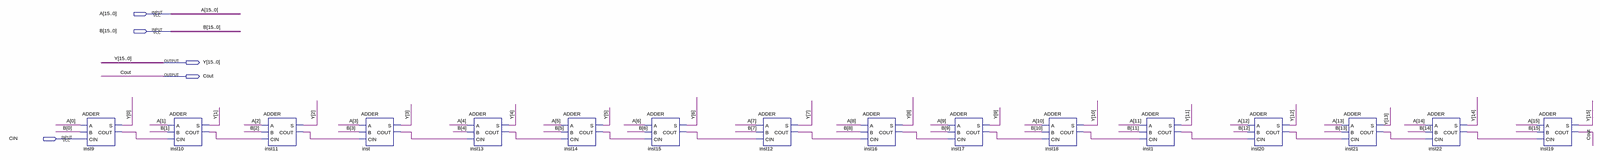
[diagram p0: schematic sheet, whole]
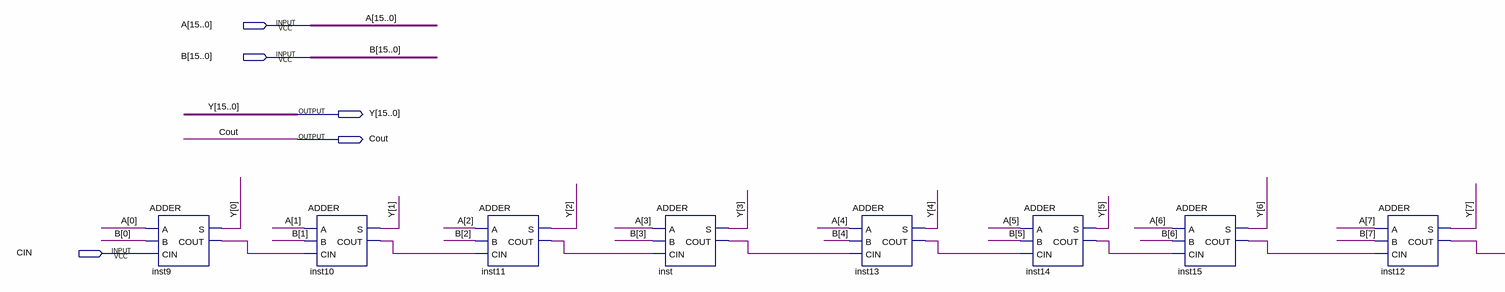
[diagram p1: schematic sheet, left part]
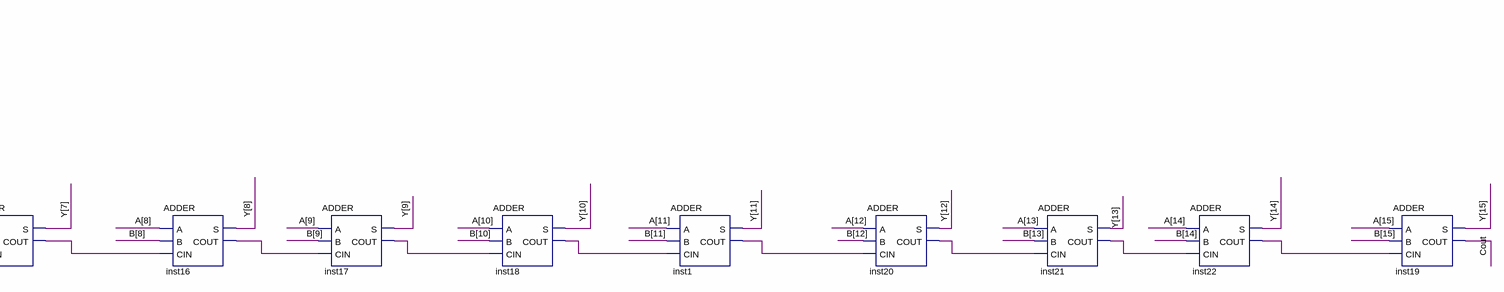
[diagram p2: schematic sheet, right part]
// Quartus schematic ADDER16bit.bdf as structural Verilog: 16 symbols, 5 pins
module ADDER16bit (
  input  [15:0] A,
  input  [15:0] B,
  input  CIN,
  output [15:0] Y,
  output Cout
);

  wire inst1_cout, inst9_cout, inst10_cout, inst11_cout, inst12_cout, inst13_cout, inst14_cout, inst15_cout,
       inst16_cout, inst17_cout, inst18_cout, inst20_cout, inst21_cout, inst22_cout, inst_cout;

  ADDER inst9 (.A(A[0]), .B(B[0]), .CIN(CIN), .S(Y[0]), .COUT(inst9_cout));
  ADDER inst10 (.A(A[1]), .B(B[1]), .CIN(inst9_cout), .S(Y[1]), .COUT(inst10_cout));
  ADDER inst11 (.A(A[2]), .B(B[2]), .CIN(inst10_cout), .S(Y[2]), .COUT(inst11_cout));
  ADDER inst (.A(A[3]), .B(B[3]), .CIN(inst11_cout), .S(Y[3]), .COUT(inst_cout));
  ADDER inst13 (.A(A[4]), .B(B[4]), .CIN(inst_cout), .S(Y[4]), .COUT(inst13_cout));
  ADDER inst14 (.A(A[5]), .B(B[5]), .CIN(inst13_cout), .S(Y[5]), .COUT(inst14_cout));
  ADDER inst15 (.A(A[6]), .B(B[6]), .CIN(inst14_cout), .S(Y[6]), .COUT(inst15_cout));
  ADDER inst12 (.A(A[7]), .B(B[7]), .CIN(inst15_cout), .S(Y[7]), .COUT(inst12_cout));
  ADDER inst16 (.A(A[8]), .B(B[8]), .CIN(inst12_cout), .S(Y[8]), .COUT(inst16_cout));
  ADDER inst17 (.A(A[9]), .B(B[9]), .CIN(inst16_cout), .S(Y[9]), .COUT(inst17_cout));
  ADDER inst18 (.A(A[10]), .B(B[10]), .CIN(inst17_cout), .S(Y[10]), .COUT(inst18_cout));
  ADDER inst1 (.A(A[11]), .B(B[11]), .CIN(inst18_cout), .S(Y[11]), .COUT(inst1_cout));
  ADDER inst20 (.A(A[12]), .B(B[12]), .CIN(inst1_cout), .S(Y[12]), .COUT(inst20_cout));
  ADDER inst21 (.A(A[13]), .B(B[13]), .CIN(inst20_cout), .S(Y[13]), .COUT(inst21_cout));
  ADDER inst22 (.A(A[14]), .B(B[14]), .CIN(inst21_cout), .S(Y[14]), .COUT(inst22_cout));
  ADDER inst19 (.A(A[15]), .B(B[15]), .CIN(inst22_cout), .S(Y[15]), .COUT(Cout));
endmodule
